# Altium project Solar.PrjPcb
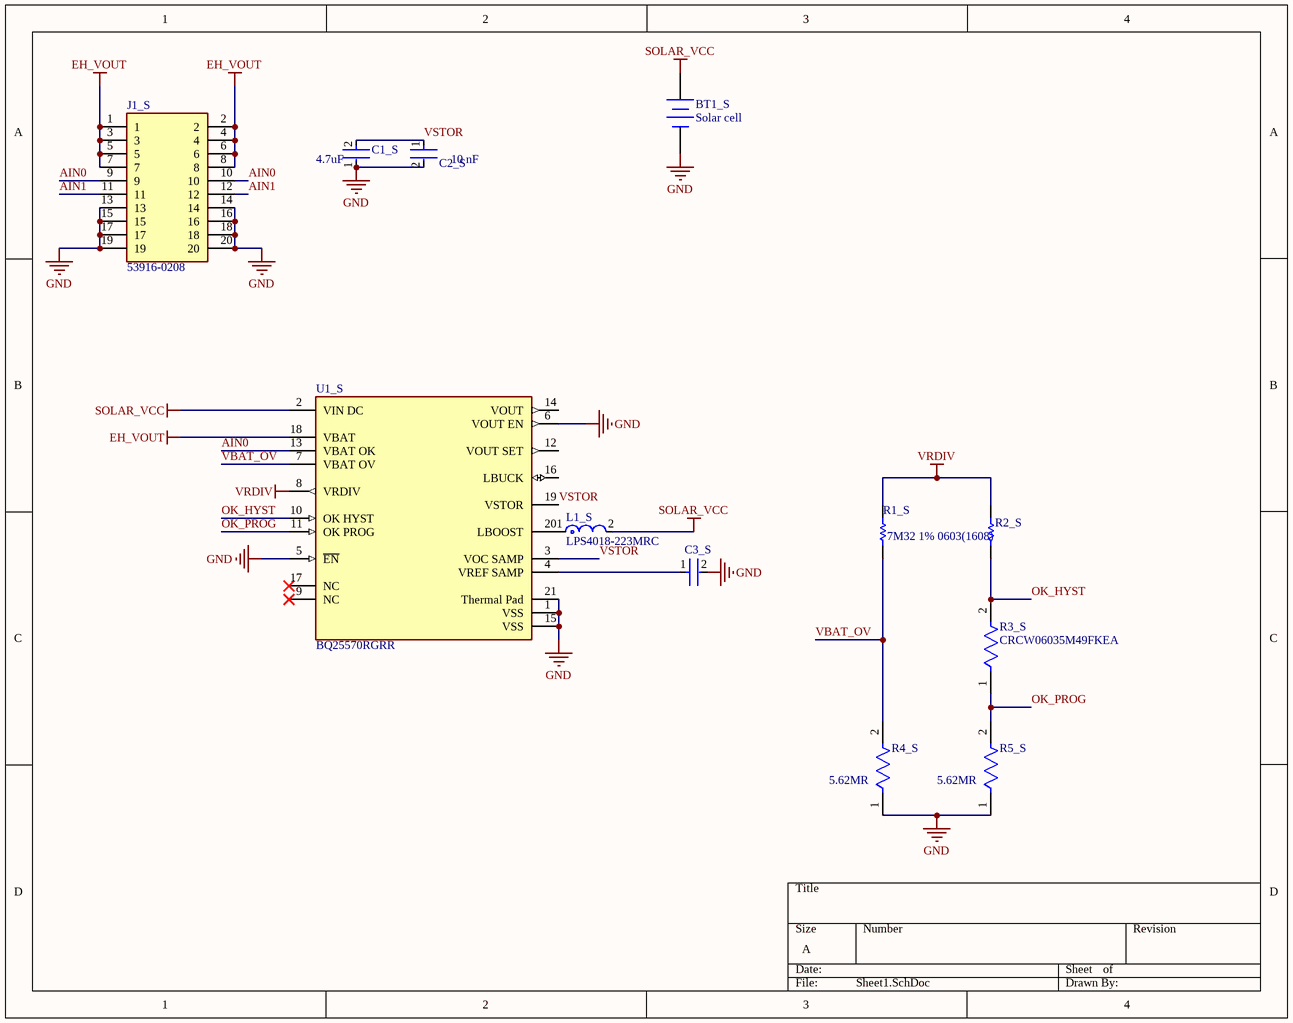
[diagram p0: Sheet1.SchDoc]
1 sheet, 12 parts. Net scope: global (net labels, ports and power ports of the same name join across sheets).
Board file: PCB1.PcbDoc

## Sheet Sheet1.SchDoc
size A; SheetNumber: 1; SheetTotal: 1

### Parts
BT1_S  Solar cell  [BAT-2]
C1_S  Capacitance: 4.7uF  [FP-GRM188-0_1-MFG]  (hidden comment: GRM188R60J475KE19D)
C2_S  Capacitance: 10 nF  [FP-CC0603-DA-MFG]  (hidden comment: CC0603KRX7R9BB103)
C3_S  CC0603KRX7R9BB103  [FP-CC0603-DA-MFG]  (value not drawn)
J1_S  53916-0208  [MOLEX-  539160208]
L1_S  LPS4018-223MRC  [FP-LPS4018-MFG]
R1_S  7M32 1% 0603(1608)  [RESC0603(1608)_N]
R2_S  CRCW06031M87FKEA  [RESC1609X50X30ML10T20]  (value not drawn)
R3_S  CRCW06035M49FKEA  [FP-CRCW0603-e3-IPC_C]
R4_S  Resistance: 5.62MR  [FP-CRCW0603-e3-IPC_B]  (hidden comment: CRCW06035M62FKEA)
R5_S  Resistance: 5.62MR  [FP-CRCW0603-e3-IPC_B]  (hidden comment: CRCW06035M62FKEA)
U1_S  BQ25570RGRR  [FP-RGR0020A-MFG]

### Nets
EH_VOUT: J1_S.1 J1_S.2 J1_S.3 J1_S.4 J1_S.5 J1_S.6 J1_S.7 J1_S.8 U1_S.18(VBAT)
GND: BT1_S.2(-) C1_S.1 C2_S.2 C3_S.2 J1_S.13 J1_S.14 J1_S.15 J1_S.16 J1_S.17 J1_S.18 J1_S.19 J1_S.20 R4_S.1 R5_S.1 U1_S.1(VSS) U1_S.5(~{EN}) U1_S.6(VOUT_EN) U1_S.15(VSS) U1_S.21(Thermal_Pad)
SOLAR_VCC: BT1_S.1(+) L1_S.2 U1_S.2(VIN_DC)
VRDIV: R1_S.2 R2_S.2 U1_S.8(VRDIV)
AIN0: J1_S.9 J1_S.10 U1_S.13(VBAT_OK)
AIN1: J1_S.11 J1_S.12
OK_HYST: R2_S.1 R3_S.2 U1_S.10(OK_HYST)
OK_PROG: R3_S.1 R5_S.2 U1_S.11(OK_PROG)
VBAT_OV: R1_S.1 R4_S.2 U1_S.7(VBAT_OV)
VSTOR: C1_S.2 C2_S.1 U1_S.3(VOC_SAMP) U1_S.19(VSTOR)
NetC3_S_1: C3_S.1 U1_S.4(VREF_SAMP)
NetL1_S_1: L1_S.1 U1_S.20(LBOOST)

Not connected (* = marked no-connect by the designer): U1_S 9(NC)* 12(VOUT_SET) 14(VOUT) 16(LBUCK) 17(NC)*

### Library data of the parts
BT1_S = Battery: Multicell Battery; Published: 24-Mar-1999; LatestRevisionDate: 17-Jul-2002; LatestRevisionNote: Re-released for DXP Platform.; PackageReference: BAT-2; Publisher: Altium Limited; PackageDescription: Battery; 2 Leads
C1_S = CMP-2006-02799-3: CAP CER 4.7UF 6.3V X5R 0603; Material: Ceramic; Tolerance: 10%; Max Operating Temperature: 85°C; REACH SVHC: No SVHC; Thickness: 0.035inch; Voltage Rating: 6.3V; Package Quantity: 1; Radiation Hardening: No; Voltage: 6.3V; Case Code (Metric): 1608; Dielectric: X5R; Mount: Surface Mount; RoHS Compliant: Yes; Height: 0.8mm; Voltage Rating (DC): 6.3V; Width: 0.8mm; Lead Free: Lead Free; Case Code (Imperial): 0603; Packaging: Tape and Reel; Length: 1.6mm; Case/Package: 0603; Termination: SMD/SMT; Min Operating Temperature: -55°C; Depth: 0.8mm
C2_S C3_S = CMP-2100-03600-2: CAP CER 10000PF 50V X7R 0603; Manufacturer: YAGEO; Tolerance: 0.1; Material: Ceramic; Temperature Coefficient: 15%; Description: CC0603 10 nF X7R 10.00% 50 V; Value: 10 nF; Mouser Description: Multilayer Ceramic Capacitor, CC Series, 0.01 - F, - 10%, X7R, 50 V, 0603 [1608 Metric]; Digikey Description: CAP CER 10000PF 50V X7R 0603; Height: 0.9mm; Category: Cap; Temperature Characteristic: X7R; Footprint Url: http://www.yageo.com/exep/pages/download/literatures/UPY-C_GEN_24.pdf; Lead Free: Yes; Voltage Rating: 50 V; Manufacturer Part Number: CC0603KRX7R9BB103; Temperature: -55°C to +125°C; Device Class L3: Ceramic Capacitors; ComponentLink2Description: Datasheet; Voltage: 50 V; Package: CC0603-DA; Octopart: https://octopart.com/cc0603krx7r9bb103-yageo-192938; Automotive: No; Temperature Range High: +125°C; Temperature Range Low: -55°C; RoHS: TRUE; Device Class L1: Passive Components; ComponentLink2URL: http://www.yageo.com/documents/recent/UPY-GPHC_X7R_6.3V-to-50V_18.pdf; Device Class L2: Capacitors
  C3_S: Capacitance: 10 nF
L1_S = CMP-11268-000029-2: Fixed Inductors LPS4018 Low Profile 22uH 0.9A 20% SMD; Max DC Current: 830mA; Core Material: Ferrite; Self Resonant Frequency: 26MHz; Test Frequency: 100kHz; Shielding: Shielded; DC Resistance (DCR): 360mR; Package Quantity: 1000; Min Operating Temperature: -40°C; Max Operating Temperature: 85°C; Packaging: Tape and Reel; Width: 4mm; Weight: 0.003527oz; Tolerance: 20%; Height: 1.7mm; Inductance: 22uH; Termination: SMD/SMT; Length: 4mm; Series: LPS4018; Case/Package: SMD/SMT
R1_S = CMP-1012-00947-1: 7M32 0.1W 1% 0603 (1608 Metric)  SMD; Case-Metric: 1608; Value: 7320000.00 Ohm; Case-EIA: 0603; Technology: SMT; Power: 0.1 W; Tolerance: 1 %
R2_S = CMP-1012-00878-2: Manufacturer: Vishay Dale; Part Number: CRCW06031M87FKEA
R3_S = CMP-02407-002627-1: RES Thick Film, 5.49MΩ, 1%, 0.1W, 100ppm/°C, 0603; Resistance: 5.49MR; Voltage Rating: 75V; Power Rating: 100mW; Temperature Coefficient: 100ppm/°C; Radiation Hardening: No; Termination: SMD/SMT; Case Code (Metric): 1608; Min Operating Temperature: -55°C; Case/Package: 0603; Composition: Thick Film; Lead Free: Lead Free; Voltage Rating (DC): 75V; Width: 0.033inch; Length: 1.55mm; Package Quantity: 10; Packaging: Tape and Reel; Max Power Dissipation: 100mW; Weight: 7.1E-05oz; Tolerance: 1%; Depth: 0.85mm; Case Code (Imperial): 0603; Number of Pins: 2; Height: 0.02inch; Features: Automotive AEC-Q200; Military Standard: Not; Max Operating Temperature: 155°C; Contact Plating: Tin; Number of Terminations: 2
R4_S R5_S = CMP-02407-011800-1: RES Thick Film, 5.62MΩ, 1%, 0.1W, 100ppm/°C, 0603; Max Power Dissipation: 100mW; Voltage Rating (DC): 75V; Contact Plating: Tin; Temperature Coefficient: 100ppm/°C; Max Operating Temperature: 155°C; Case Code (Imperial): 0603; Width: 0.033inch; Depth: 0.85mm; Military Standard: Not; Lead Free: Lead Free; Length: 1.55mm; Features: Automotive AEC-Q200; Resistor Type: Thick Film; Case/Package: 0603; Construction: Rectangular; Number of Pins: 2; Power Rating: 100mW; Series: CRCW; Height: 0.02inch; Min Operating Temperature: -55°C; Case Code (Metric): 1608; Package Quantity: 10; RoHS Compliant: Yes; Packaging: Tape and Reel; Voltage Rating: 75V; Weight: 7.1E-05oz; Number of Terminations: 2; Resistance Tolerance: 1%; Tolerance: 1%
U1_S = CMP-04911-000040-1: IC ENERGY HARV CTRLR BATT 20VQFN; Operating Supply Current: 488nA; Switching Frequency: 1MHz; Operating Supply Voltage: 4V; Output Current: 100mA; Packaging: Tape and Reel; Lead Free: Lead Free; Contact Plating: Gold; RoHS Compliant: Yes; Mount: Surface Mount; Case/Package: VQFN; Min Operating Temperature: -40°C; Max Operating Temperature: 125°C; Package Quantity: 3000; Number of Pins: 20

## Assembly variants
Variant of Solar: all parts fitted